# EAGLE design ESP_Robo_Board (EAGLE 9.6.2)
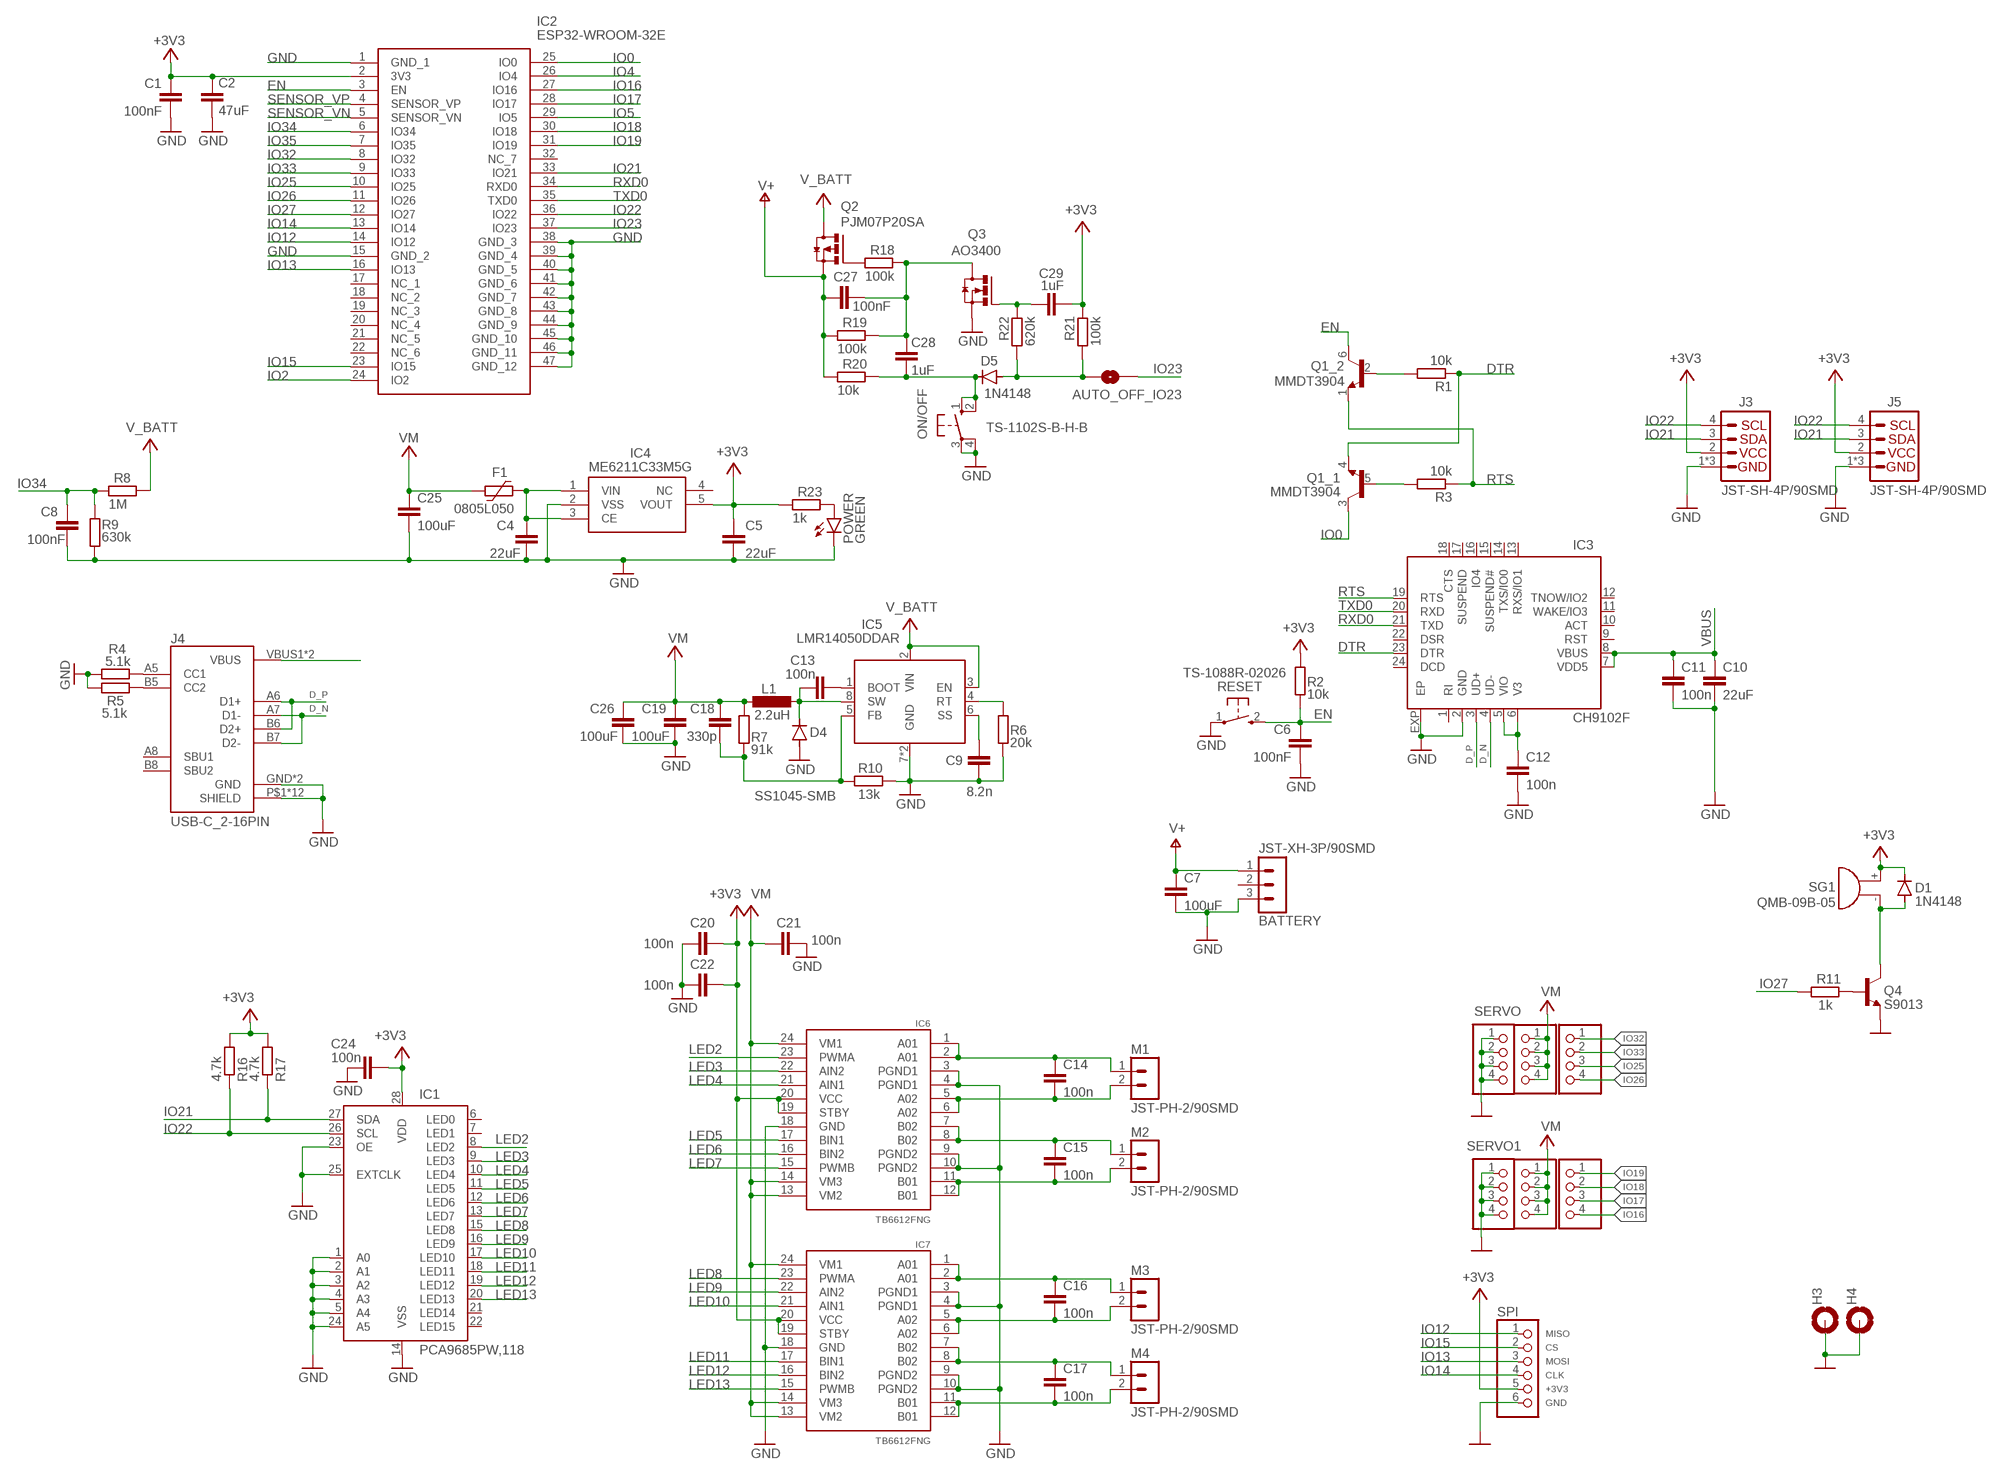
[diagram p0: schematic, sheet 1]

## Parts
1  PINHD_1X4_RED  PINHD-1X4  [1X04]
2  PINHD_1X4_BLACK  PINHD-1X4  [1X04]
5  PINHD_1X4_RED  PINHD-1X4  [1X04]
6  PINHD_1X4_BLACK  PINHD-1X4  [1X04]
AUTO_OFF_IO23  nv  JUMPER-SMT_2_NO_SILK  [SMT-JUMPER_2_NO_SILK]
BATTERY  JST-XH-3P/90SMD  JST-XH-3/90SMD  [S3B-XH-SM4]
C1  100nF  C-EUC0603  [C0603]
C2  47uF  C-EUC0805  [C0805]
C4  22uF  C-EUC0603  [C0603]
C5  22uF  C-EUC0603  [C0603]
C6  100nF  CAPACITOR_0402  [C0402]
C7  100uF  C-EUC1206  [C1206]
C8  100nF  CAPACITOR_0402  [C0402]
C9  8.2n  C-EUC0603  [C0603]
C10  22uF  C-EUC0603  [C0603]
C11  100n  CAPACITOR_0402  [C0402]
C12  100n  CAPACITOR_0402  [C0402]
C13  100n  C-EUC0603  [C0603]
C14  100n  C-EUC0603  [C0603]
C15  100n  C-EUC0603  [C0603]
C16  100n  C-EUC0603  [C0603]
C17  100n  C-EUC0603  [C0603]
C18  330p  CAPACITOR_0402  [C0402]
C19  100uF  C-EUC1206  [C1206]
C20  100n  C-EUC0603  [C0603]
C21  100n  C-EUC0603  [C0603]
C22  100n  C-EUC0603  [C0603]
C24  100n  C-EUC0603  [C0603]
C25  100uF  C-EUC1206  [C1206]
C26  100uF  C-EUC1206  [C1206]
C27  100nF  CAPACITOR_0402  [C0402]
C28  1uF  C-EUC0603  [C0603]
C29  1uF  C-EUC0603  [C0603]
D1  1N4148  DIODE-SOD323-R  [SOD323-R]
D4  SS1045-SMB  DIODE-SMB  [SMB]
D5  1N4148  DIODE-SOD323-R  [SOD323-R]
F1  0805L050  [0805L]
H3  MOUNT-PAD-ROUND2.5  [2,5-PAD]
H4  MOUNT-PAD-ROUND2.5  [2,5-PAD]
IC1  PCA9685PW,118  [TSSOP28]
IC2  ESP32-WROOM-32E  [ESP32WROOM32E]
IC3  CH9102F  USB_UART_CONVERTOR_CH9102  [QFN24-4X4]
IC4  ME6211C33M5G  LDO_ME6211C33M5G  [SOT23-5]
IC5  LMR14050DDAR  [SO08-EPAD]
IC6  TB6612FNG  MOTOR_DRIVER_TB6612FNG  [SSOP24]
IC7  TB6612FNG  MOTOR_DRIVER_TB6612FNG  [SSOP24]
J3  JST-SH-4P/90SMD  USUP_CONNECTOR_HOR  [1X04_1MM_RA]
J4  USB-C_2-16PIN  [USBC_USB-C-16P-5]
J5  JST-SH-4P/90SMD  USUP_CONNECTOR_HOR  [1X04_1MM_RA]
L1  2.2uH  INDUCTOR_5.4X5.2  [L5.4X5.2]
M1  JST-PH-2/90SMD  [S2B-PH-SM4]
M2  JST-PH-2/90SMD  [S2B-PH-SM4]
M3  JST-PH-2/90SMD  [S2B-PH-SM4]
M4  JST-PH-2/90SMD  [S2B-PH-SM4]
ON/OFF  TS-1102S-B-H-B  10-XX-SMD  [B3F-SMD]
POWER  GREEN  LEDCHIPLED_0402  [CHIPLED_0402]
Q1  MMDT3904  TRANS_NPN_DUAL-MBT3904DW1T1  [SC70-6]
Q2  PJM07P20SA  MOSFET_P-SOT-23  [SOT23]
Q3  AO3400  MOSFET_N-SOT-23  [SOT23]
Q4  S9013  BC817-16-NPN-SOT23-BEC  [SOT23-BEC]
R1  10k  R-EU_R0402  [R0402]
R2  10k  R-EU_R0402  [R0402]
R3  10k  R-EU_R0402  [R0402]
R4  5.1k  R-EU_R0402  [R0402]
R5  5.1k  R-EU_R0402  [R0402]
R6  20k  R-EU_R0402  [R0402]
R7  91k  R-EU_R0402  [R0402]
R8  1M  R-EU_R0402  [R0402]
R9  630k  R-EU_R0402  [R0402]
R10  13k  R-EU_R0402  [R0402]
R11  1k  R-EU_R0402  [R0402]
R16  4.7k  R-EU_R0402  [R0402]
R17  4.7k  R-EU_R0402  [R0402]
R18  100k  R-EU_R0402  [R0402]
R19  100k  R-EU_R0402  [R0402]
R20  10k  R-EU_R0402  [R0402]
R21  100k  R-EU_R0402  [R0402]
R22  620k  R-EU_R0402  [R0402]
R23  1k  R-EU_R0402  [R0402]
RESET  TS-1088R-02026  MOMENTARY_SWITCH_TS-1088R-02026  [TS1088R02026]
SERVO  PINHD_1X4_YELLOW  PINHD-1X4  [1X04]
SERVO1  PINHD_1X4_YELLOW  PINHD-1X4  [1X04]
SG1  QMB-09B-05  PASSIVE_5V_9/4MM  [9/4MM]
SPI  PINHD-1X6  [1X06]

## Nets
+3V3: C1.1 C2.1 C5.1 C20.2 C22.2 C24.2 C29.1 D1.C IC1.28(VDD) IC2.2(3V3) IC4.5(VOUT) IC6.19(STBY) IC6.20(VCC) IC7.19(STBY) IC7.20(VCC) J3.2(VCC) J5.2(VCC) R2.1 R16.2 R17.2 R21.2 R23.1 SG1.+ SPI.5
+6V: 1.1 1.2 1.3 1.4 5.1 5.2 5.3 5.4 C18.1 C19.1 C21.1 C25.1 C26.1 F1.2 IC6.13(VM2) IC6.14(VM3) IC6.24(VM1) IC7.13(VM2) IC7.14(VM3) IC7.24(VM1) L1.2 R7.1 ; supply symbol labelled VM
D_N: IC3.4(UD-) J4.A7(D1-) J4.B7(D2-)
D_P: IC3.3(UD+) J4.A6(D1+) J4.B6(D2+)
DTR: IC3.23(DTR) Q1.4(_1:E) R1.1
EN: C6.1 IC2.3(EN) Q1.6(_2:C) R2.2 RESET.2
GND: 2.1 2.2 2.3 2.4 6.1 6.2 6.3 6.4 BATTERY.3 C1.2 C2.2 C4.2 C5.2 C6.2 C7.2 C8.2 C9.2 C10.2 C11.2 C12.2 C19.2 C20.1 C21.2 C22.1 C24.1 C25.2 C26.2 D4.A H3.1(MOUNT) H4.1(MOUNT) IC1.1(A0) IC1.2(A1) IC1.3(A2) IC1.4(A3) IC1.5(A4) IC1.14(VSS) IC1.23(OE) IC1.24(A5) IC1.25(EXTCLK) IC2.1(GND_1) IC2.15(GND_2) IC2.38(GND_3) IC2.39(GND_4) IC2.40(GND_5) IC2.41(GND_6) IC2.42(GND_7) IC2.43(GND_8) IC2.44(GND_9) IC2.45(GND_10) IC2.46(GND_11) IC2.47(GND_12) IC3.2(GND) IC3.EXP(EP) IC4.2(VSS) IC5.7(GND) IC5.EPAD(GND) IC6.3(PGND1) IC6.4(PGND1) IC6.9(PGND2) IC6.10(PGND2) IC6.18(GND) IC7.3(PGND1) IC7.4(PGND1) IC7.9(PGND2) IC7.10(PGND2) IC7.18(GND) J3.1(GND) J3.NC1(GND) J3.NC2(GND) J4.GND J4.GND2(GND) J4.P$1(SHIELD) J4.P$2(SHIELD) J4.P$3(SHIELD) J4.P$4(SHIELD) J4.SHLD1(SHIELD) J4.SHLD2(SHIELD) J4.SHLD3(SHIELD) J4.SHLD4(SHIELD) J4.SHLD5(SHIELD) J4.SHLD6(SHIELD) J4.SHLD7(SHIELD) J4.SHLD8(SHIELD) J5.1(GND) J5.NC1(GND) J5.NC2(GND) ON/OFF.3(P) ON/OFF.4(P1) POWER.C Q3.2(S) Q4.E R4.1 R5.1 R6.2 R9.1 R10.2 RESET.1 SPI.6
IO0: IC2.25(IO0) Q1.3(_1:C)
IO2: IC2.24(IO2)
IO4: IC2.26(IO4)
IO5: IC2.29(IO5)
IO12: IC2.14(IO12) SPI.1
IO13: IC2.16(IO13) SPI.3
IO14: IC2.13(IO14) SPI.4
IO15: IC2.23(IO15) SPI.2
IO16: IC2.27(IO16) SERVO1.4
IO17: IC2.28(IO17) SERVO1.3
IO18: IC2.30(IO18) SERVO1.2
IO19: IC2.31(IO19) SERVO1.1
IO21: IC1.27(SDA) IC2.33(IO21) J3.3(SDA) J5.3(SDA) R17.1
IO22: IC1.26(SCL) IC2.36(IO22) J3.4(SCL) J5.4(SCL) R16.1
IO23: AUTO_OFF_IO23.2 IC2.37(IO23)
IO25: IC2.10(IO25) SERVO.3
IO26: IC2.11(IO26) SERVO.4
IO27: IC2.12(IO27) R11.1
IO32: IC2.8(IO32) SERVO.1
IO33: IC2.9(IO33) SERVO.2
IO34: C8.1 IC2.6(IO34) R8.1 R9.2
IO35: IC2.7(IO35)
LED2: IC1.8(LED2) IC6.23(PWMA)
LED3: IC1.9(LED3) IC6.22(AIN2)
LED4: IC1.10(LED4) IC6.21(AIN1)
LED5: IC1.11(LED5) IC6.17(BIN1)
LED6: IC1.12(LED6) IC6.16(BIN2)
LED7: IC1.13(LED7) IC6.15(PWMB)
LED8: IC1.15(LED8) IC7.23(PWMA)
LED9: IC1.16(LED9) IC7.22(AIN2)
LED10: IC1.17(LED10) IC7.21(AIN1)
LED11: IC1.18(LED11) IC7.17(BIN1)
LED12: IC1.19(LED12) IC7.16(BIN2)
LED13: IC1.20(LED13) IC7.15(PWMB)
N$1: C4.1 F1.1 IC4.1(VIN) IC4.3(CE)
N$2: J4.A5(CC1) R4.2
N$3: C13.1 D4.C IC5.8(SW) L1.1
N$4: Q1.5(_1:B) R3.2
N$5: C9.1 IC5.6(SS)
N$6: IC5.4(RT) R6.1
N$7: J4.B5(CC2) R5.2
N$8: Q4.B R11.2
N$9: POWER.A R23.2
N$10: C13.2 IC5.1(BOOT)
N$12: Q1.2(_2:B) R1.2
N$14: D1.A Q4.C SG1.-
N$15: C12.1 IC3.5(VIO) IC3.6(V3)
N$17: C18.2 IC5.5(FB) R7.2 R10.1
N$18: C14.1 IC6.1(A01) IC6.2(A01) M1.1
N$19: C14.2 IC6.5(A02) IC6.6(A02) M1.2
N$20: C15.1 IC6.7(B02) IC6.8(B02) M2.1
N$22: Q2.1(G) R18.1
N$23: C15.2 IC6.11(B01) IC6.12(B01) M2.2
N$24: C16.1 IC7.1(A01) IC7.2(A01) M3.1
N$25: C28.2 D5.C ON/OFF.1(S) ON/OFF.2(S1) R20.2
N$26: C16.2 IC7.5(A02) IC7.6(A02) M3.2
N$27: C17.1 IC7.7(B02) IC7.8(B02) M4.1
N$28: C27.2 C28.1 Q3.3(D) R18.2 R19.2
N$29: C17.2 IC7.11(B01) IC7.12(B01) M4.2
N$30: C29.2 Q3.1(G) R22.2
N$31: AUTO_OFF_IO23.1 D5.A R21.1 R22.1
RTS: IC3.19(RTS) Q1.1(_2:E) R3.1
RXD0: IC2.34(RXD0) IC3.21(TXD)
SENSOR_VN: IC2.5(SENSOR_VN)
SENSOR_VP: IC2.4(SENSOR_VP)
TXD0: IC2.35(TXD0) IC3.20(RXD)
V+: BATTERY.1 C7.1 C27.1 Q2.2(S) R19.1 R20.1
V_BATT: IC5.2(VIN) IC5.3(EN) Q2.3(D) R8.2
VBUS: C10.1 C11.1 IC3.7(VDD5) IC3.8(VBUS) J4.VBUS1(VBUS) J4.VBUS2(VBUS)
Unconnected: BATTERY.2 IC1.6(LED0) IC1.7(LED1) IC1.21(LED14) IC1.22(LED15) IC2.17(NC_1) IC2.18(NC_2) IC2.19(NC_3) IC2.20(NC_4) IC2.21(NC_5) IC2.22(NC_6) IC2.32(NC_7) IC3.1(RI) IC3.9(RST) IC3.10(ACT) IC3.11(WAKE/IO3) IC3.12(TNOW/IO2) IC3.13(RXS/IO1) IC3.14(TXS/IO0) IC3.15(SUSPEND#) IC3.16(IO4) IC3.17(SUSPEND) IC3.18(CTS) IC3.22(DSR) IC3.24(DCD) IC4.4(NC) J4.A8(SBU1) J4.B8(SBU2)

## Notes on the sheet
- MISO
- CS
- MOSI
- CLK
- +3V3
- GND

## Library data of the parts
1 2 5 6 SERVO SERVO1 = LasKKit-Connectors:PINHD-1X4: PIN HEADER
AUTO_OFF_IO23 = LaskaKit-Jumpers:JUMPER-SMT_2_NO: Normally open jumper This jumper has two pads in close proximity to each other. Apply solder to close the connection. Round pads are easier to solder for beginners, but are a lot larger. SparkFun Product that uses the round pads: SparkFun EL Sequencer <https://www.sparkfun.com/products/12781>
BATTERY = LasKKit-Connectors:JST-XH-3
C1 C2 C4 C7 C9 C10 C13-C17 C19-C22 C24-C26 C28 C29 = rcl:C-EU: CAPACITOR, European symbol; SPICEPREFIX: C
C5 = rcl:C-EU: CAPACITOR, European symbol; LCSC_PART: C19666; SPICEPREFIX: C
C6 C8 C11 C12 C18 C27 = LasKKIT-Passive:CAPACITOR
D1 = diode:DIODE-: DIODE; LCSC_PART: C94001
D4 = diode:DIODE-: DIODE; LCSC_PART: C2903947
D5 = LasKKit-Discrete:DIODE-: DIODE
F1 = polyfuse-smd_10:?: Polyfuse Resettable PTC Source: http://www.littelfuse.com/products/resettable-ptcs.aspx; LCSC_PART: C66452; MF: Littelfuse; MPN: 0805L050; OC_FARNELL: 1832103; OC_NEWARK: 18M4776
H3 H4 = LasKKit-Holes:MOUNT-PAD-ROUND: MOUNTING PAD, round
IC1 = LasKKit-IC:PCA9685: 16-channel, 12-bit PWM Fm+ I2C-bus LED controller; LCSC_PART: C2678753
IC2 = LasKKit-Modules:ESP32-WROOM-32E: ESP32-D0WD-V3 embedded, Xtensa dual-core 32-bit LX6 microprocessor, up to 240 MHz Source: Datasheet <https://www.espressif.com/sites/default/files/documentation/esp32-wroom-32e_esp32-wroom-32ue_datasheet_en.pdf>; DESCRIPTION: ESP32-D0WD-V3 embedded, Xtensa dual-core 32-bit LX6 microprocessor, up to 240 MHz; HEIGHT: 3.25mm; MANUFACTURER_NAME: Espressif Systems; MANUFACTURER_PART_NUMBER: ESP32-WROOM-32E
IC3 = LasKKit-IC:USB_UART_CONVERTOR_CH9102: Single-Chip USB to UART Bridge
IC4 = LasKKit-Power:LDO_ME6211C33M5G: High Speed LDO Regulators, High PSRR, Low noise, ME6211 Series Source: Datasheet <http://xinhuidianzi.com.cn/UploadSysFiles/files/LDO-series/ME6211-Series_E15.0.pdf>; DESCRIPTION: High Speed LDO Regulators, High PSRR, Low noise, ME6211 Series; HEIGHT: 1.45mm; MANUFACTURER_NAME: Microne; MANUFACTURER_PART_NUMBER: ME6211C33M5G
IC5 = LasKKit-Power:LMR14050; LCSC_PART: C155484
IC6 IC7 = LasKKit-IC:MOTOR_DRIVER_TB6612FNG: Toshiba 1A dual motor driver IC-09363; PROD_ID: IC-09363
J3 J5 = LasKKit-Connectors:USUP_CONNECTOR: LaskaKit I2C Standard Šup Connector An SMD 1mm pitch JST connector makes it easy and quick (Šup) to connect I2C devices to each other. The Šup system enables fast and solderless connection between popular platforms and various sensors and actuators. We carry 200mm <https://www.sparkfun.com/products/14204>, 100mm <https://www.sparkfun.com/products/14205>, 50mm <https://www.sparkfun.com/products/14206>, and breadboard friendly <https://www.sparkfun.com/products/14207> Qwiic cables. We also offer 10 pcs strips <https://www.sparkfun.com/products/14323> the SMD connectors.; LCSC_PART: C145956
J4 = LasKKit-Connectors:USB-C_2: https://lcsc.com/product-detail/USB-Connectors_G-Switch-GT-USB-7010B_C2837092.html; LCSC_PART: C2837092
L1 = LasKKIT-Passive:INDUCTOR; LCSC_PART: C351096
M1-M4 = LasKKit-Connectors:JST-PH-2: HEADER; LCSC_PART: C47647
ON/OFF = LasKKit-Switch:10-XX: OMRON SWITCH
POWER = LasKKit-Discrete:LED: LED OSRAM: - CHIPLED LG R971, LG N971, LY N971, LG Q971, LY Q971, LO R971, LY R971 LH N974, LH R974 LS Q976, LO Q976, LY Q976 LO Q996 - Hyper CHIPLED LW Q18S LB Q993, LB Q99A, LB R99A - SideLED LS A670, LO A670, LY A670, LG A670, LP A670 LB A673, LV A673, LT A673, LW A673 LH A674 LY A675 LS A676, LA A676, LO A676, LY A676, LW A676 LS A679, LY A679, LG A679 - Hyper Micro SIDELED® LS Y876, LA Y876, LO Y876, LY Y876 LT Y87S - SmartLED LW L88C, LW L88S LB L89C, LB L89S, LG L890 LS L89K, LO L89K, LY L89K LS L896, LA L896, LO L896, LY L896 - TOPLED LS T670, LO T670, LY T670, LG T670, LP T670 LSG T670, LSP T670, LSY T670, LOP T670, LYG T670 LG T671, LOG T671, LSG T671 LB T673, LV T673, LT T673, LW T673 LH T674 LS T676, LA T676, LO T676, LY T676, LB T676, LH T676, LSB T676, LW T676 LB T67C, LV T67C, LT T67C, LS T67K, LO T67K, LY T67K, LW E67C LS E67B, LA E67B, LO E67B, LY E67B, LB E67C, LV E67C, LT E67C LW T67C LS T679, LY T679, LG T679 LS T770, LO T770, LY T770, LG T770, LP T770 LB T773, LV T773, LT T773, LW T773 LH T774 LS E675, LA E675, LY E675, LS T675 LS T776, LA T776, LO T776, LY T776, LB T776 LHGB T686 LT T68C, LB T68C - Hyper Mini TOPLED® LB M676 - Mini TOPLED Santana® LG M470 LS M47K, LO M47K, LY M47K Source: http://www.osram.convergy.de LUXEON: - LUMILED® LXK2-PW12-R00, LXK2-PW12-S00, LXK2-PW14-U00, LXK2-PW14-V00 LXK2-PM12-R00, LXK2-PM12-S00, LXK2-PM14-U00 LXK2-PE12-Q00, LXK2-PE12-R00, LXK2-PE12-S00, LXK2-PE14-T00, LXK2-PE14-U00 LXK2-PB12-K00, LXK2-PB12-L00, LXK2-PB12-M00, LXK2-PB14-N00, LXK2-PB14-P00, LXK2-PB14-Q00 LXK2-PR12-L00, LXK2-PR12-M00, LXK2-PR14-Q00, LXK2-PR14-R00 LXK2-PD12-Q00, LXK2-PD12-R00, LXK2-PD12-S00 LXK2-PH12-R00, LXK2-PH12-S00 LXK2-PL12-P00, LXK2-PL12-Q00, LXK2-PL12-R00 Source: www.luxeon.com KINGBRIGHT: KA-3528ASYC Source: www.kingbright.com
Q1 = LasKKit-Discrete:TRANS_NPN_DUAL: Dual NPN Transistors in Single Package The MBT3904W1 puts two general purpose 3904 NPN transistors in a single package. Datasheet <http://www.onsemi.com/pub_link/Collateral/MBT3904DW1T1-D.PDF> SparkFun Products: SparkFun ESP32 Thing <https://www.sparkfun.com/products/13907>; LCSC_PART: C268586; PROD_ID: TRANS-13337
Q2 = LasKKit-Discrete:MOSFET_P; LCSC_PART: C2856842
Q3 = LasKKit-Discrete:MOSFET_N; LCSC_PART: C693097
Q4 = transistor:*-NPN-: NPN Transistror BF959 corrected 2008.03.06; LCSC_PART: C52801
R1-R10 R16-R23 = rcl:R-EU_: RESISTOR, European symbol; SPICEPREFIX: R
R11 = rcl:R-EU_: RESISTOR, European symbol; LCSC_PART: C22548; SPICEPREFIX: R
RESET = LasKKit-Switch:MOMENTARY_SWITCH_TS-1088R-02026: SMD,3x4x2.0mm Tactile Switches Source: Datasheet <https://datasheet.lcsc.com/szlcsc/1912111437_XUNPU-TS-1088R-02026_C455280.pdf>; DESCRIPTION: SMD,3x4x2.0mm Tactile Switches; HEIGHT: 2.2mm; LCSC_PART: C455280; MANUFACTURER_NAME: XUNPU; MANUFACTURER_PART_NUMBER: TS-1088R-02026
SG1 = LasKKit-Electromechanical:PASSIVE_5V: BUZZER Source: Buerklin; LCSC_PART: C161819
SPI = LasKKit-Connectors:PINHD-1X6: PIN HEADER

## Net classes
1 power: width 0.152 mm, drill 0.33 mm, clearance 0.152 mm

## Board
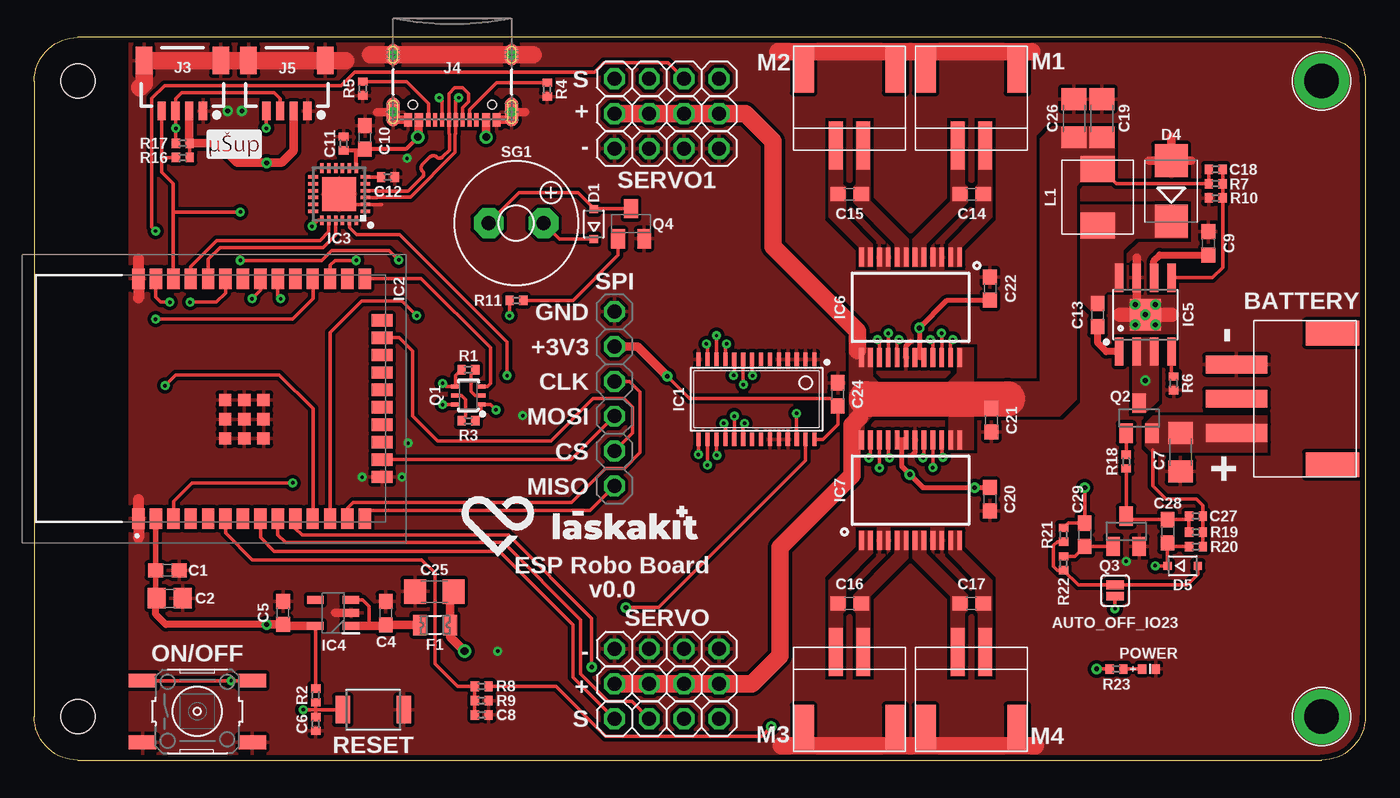
[diagram p1: board, top side]
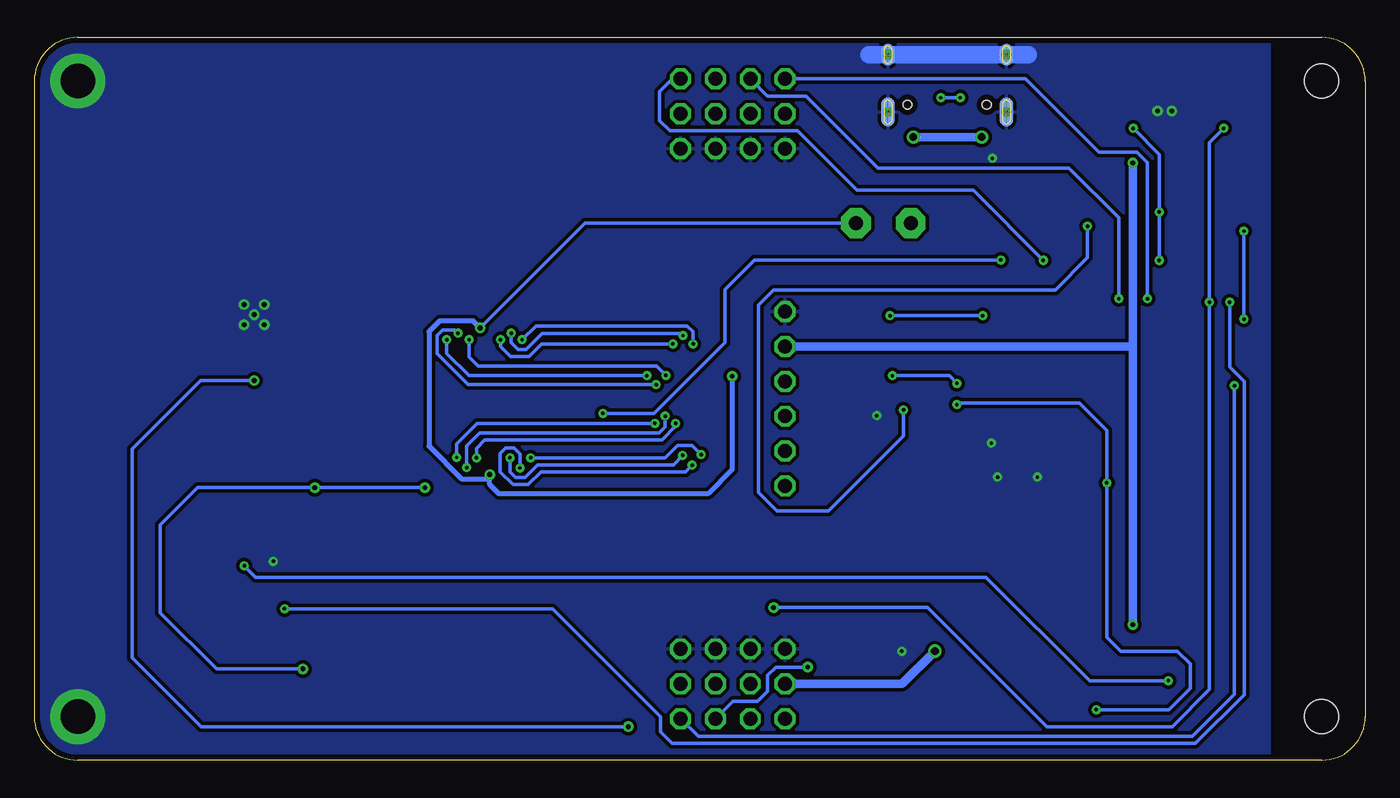
[diagram p2: board, bottom side, seen from below]

Size 97.03 x 52.7 mm. Coordinates in mm from the lower left corner, seen from the top.
Outline: 3.17,0 93.85,0 arc90 97.03,3.17 97.03,49.53 arc90 93.85,52.7 3.17,52.7 arc90 0,49.53 0,3.17 arc90 3.17,0
Copper layers (1*16): Top 0.035mm / dielectric 1.5mm / Bottom 0.035mm
Design rules "default *": minimum track width 10mil, minimum drill 0.35mm, track to track 6mil, track to pad 6mil, pad to pad 6mil, via to via 6mil, smd to smd 6mil, copper to edge 16mil, drill to drill 6mil, minimum pad ring 10mil, minimum via ring 8mil, stop-mask expansion 4mil, vias tented up to drill 25mil, thermal gap 10mil
Holes 2.5 mm at 3.17,3.17 3.17,49.53

### Footprints (pad centres in the part's own frame; a part is rotated, then mirrored left to right if it is on the bottom)
1X04 = drill 1.016 octagon: 1 -3.81,0; 2 -1.27,0; 3 1.27,0; 4 3.81,0
SMT-JUMPER_2_NO_SILK = smd 0.635 x 1.27: 1 -0.406,0; 2 0.406,0
S3B-XH-SM4 = smd 1.3 x 4.5: 1 2.5,-8.75; 2 0,-8.75; 3 -2.5,-8.75 | smd 1.8 x 3.9: P$1 -4.8,-1.75; P$2 4.8,-1.75
C0603 = smd 1.1 x 1: 1 -0.85,0; 2 0.85,0
C0805 = smd 1.3 x 1.5: 1 -0.95,0; 2 0.95,0
C0402 = smd 0.6 x 0.7: 1 -0.5,0; 2 0.5,0
C1206 = smd 1.6 x 1.8: 1 -1.4,0; 2 1.4,0
SOD323-R = smd 0.6 x 0.6: A 1.1,0; C -1.1,0
SMB = smd 2.4 x 2.4: A 2.2,0; C -2.2,0
0805L = smd 1 x 1.5: 1 -1.1,0; 2 1.1,0
2,5-PAD = drill 2.5 pad 4: 1 0,0
TSSOP28 = smd 0.305 x 0.991: 1 -4.225,-2.918; 2 -3.575,-2.918; 3 -2.925,-2.918; 4 -2.275,-2.918; 5 -1.625,-2.918; 6 -0.975,-2.918; 7 -0.325,-2.918; 8 0.325,-2.918; 9 0.975,-2.918; 10 1.625,-2.918; 11 2.275,-2.918; 12 2.925,-2.918; 13 3.575,-2.918; 14 4.225,-2.918; 15 4.225,2.918; 16 3.575,2.918; 17 2.925,2.918; 18 2.275,2.918; 19 1.625,2.918; 20 0.975,2.918; 21 0.325,2.918; 22 -0.325,2.918; 23 -0.975,2.918; 24 -1.625,2.918; 25 -2.275,2.918; 26 -2.925,2.918; 27 -3.575,2.918; 28 -4.225,2.918
ESP32WROOM32E = smd 1.5 x 0.9: 1 -8.742,8.28; 2 -8.742,7.01; 3 -8.742,5.74; 4 -8.742,4.47; 5 -8.742,3.2; 6 -8.742,1.93; 7 -8.742,0.66; 8 -8.742,-0.61; 9 -8.742,-1.88; 10 -8.742,-3.15; 11 -8.742,-4.42; 12 -8.742,-5.69; 13 -8.742,-6.96; 14 -8.742,-8.23; 25 8.758,-8.23; 26 8.758,-6.96; 27 8.758,-5.69; 28 8.758,-4.42; 29 8.758,-3.15; 30 8.758,-1.88; 31 8.758,-0.61; 32 8.758,0.66; 33 8.758,1.93; 34 8.758,3.2; 35 8.758,4.47; 36 8.758,5.74; 37 8.758,7.01; 38 8.758,8.28 | smd 0.9 x 1.5: 15 -5.702,-9.48; 16 -4.432,-9.48; 17 -3.162,-9.48; 18 -1.892,-9.48; 19 -0.622,-9.48; 20 0.648,-9.48; 21 1.918,-9.48; 22 3.188,-9.48; 23 4.458,-9.48; 24 5.728,-9.48 | smd 0.9 x 0.9: 39 -1.492,0.56; 40 -1.492,-0.84; 41 -0.092,-0.84; 42 -0.092,0.56; 43 -0.092,1.96; 44 -1.492,1.96; 45 -2.892,1.96; 46 -2.892,0.56; 47 -2.892,-0.84
QFN24-4X4 = smd 0.7 x 0.25: 1 -1.9,1.25; 2 -1.9,0.75; 3 -1.9,0.25; 4 -1.9,-0.25; 5 -1.9,-0.75; 6 -1.9,-1.25; 13 1.9,-1.25; 14 1.9,-0.75; 15 1.9,-0.25; 16 1.9,0.25; 17 1.9,0.75; 18 1.9,1.25 | smd 0.25 x 0.7: 7 -1.25,-1.9; 8 -0.75,-1.9; 9 -0.25,-1.9; 10 0.25,-1.9; 11 0.75,-1.9; 12 1.25,-1.9; 19 1.25,1.9; 20 0.75,1.9; 21 0.25,1.9; 22 -0.25,1.9; 23 -0.75,1.9; 24 -1.25,1.9 | smd 2.45 x 2.45: EXP 0,0
SOT23-5 = smd 1.2 x 0.6: 1 -1.3,0.95; 2 -1.3,0; 3 -1.3,-0.95; 4 1.3,-0.95; 5 1.3,0.95
SO08-EPAD = smd 0.61 x 2.057: 1 -1.905,-2.692; 2 -0.635,-2.692; 3 0.635,-2.692; 4 1.905,-2.692; 5 1.905,2.692; 6 0.635,2.692; 7 -0.635,2.692; 8 -1.905,2.692 | smd 2.286 x 2.286: EPAD 0,0
SSOP24 = smd 0.348 x 1.397: 1 -3.575,-3.656; 2 -2.925,-3.656; 3 -2.275,-3.656; 4 -1.625,-3.656; 5 -0.975,-3.656; 6 -0.325,-3.656; 7 0.325,-3.656; 8 0.975,-3.656; 9 1.625,-3.656; 10 2.275,-3.656; 11 2.925,-3.656; 12 3.575,-3.656; 13 3.575,3.656; 14 2.925,3.656; 15 2.275,3.656; 16 1.625,3.656; 17 0.975,3.656; 18 0.325,3.656; 19 -0.325,3.656; 20 -0.975,3.656; 21 -1.625,3.656; 22 -2.275,3.656; 23 -2.925,3.656; 24 -3.575,3.656
1X04_1MM_RA = smd 0.6 x 1.35: 1 1.5,-1.555; 2 0.5,-1.555; 3 -0.5,-1.555; 4 -1.5,-1.555 | smd 1.2 x 2: NC1 -2.8,2.12; NC2 2.8,2.12
USBC_USB-C-16P-5 = smd 0.3 x 1: A5 -1.25,-0.34; A6 -0.25,-0.34; A7 0.25,-0.34; A8 1.25,-0.34; B5 1.75,-0.34; B6 0.75,-0.34; B7 -0.75,-0.34; B8 -1.75,-0.34 | smd 0.6 x 1: GND -3.225,-0.34; GND2 3.225,-0.34; VBUS1 -2.45,-0.34; VBUS2 2.45,-0.34 | drill 0.2 pad 0.254: P$1 -4.32,-0.915; P$2 -4.32,-5.095; P$3 4.32,-5.095; P$4 4.32,-0.915 | smd 1 x 2.1: SHLD1 -4.32,-0.915; SHLD2 4.32,-0.915 | smd 1 x 2.1 bottom: SHLD3 -4.32,-0.915; SHLD4 4.32,-0.915 | smd 1 x 1.6: SHLD5 -4.32,-5.095; SHLD8 4.32,-5.095 | smd 1 x 1.6 bottom: SHLD6 -4.32,-5.095; SHLD7 4.32,-5.095 | hole 0.65: -2.89,-1.445; 2.89,-1.445
L5.4X5.2 = smd 1.895 x 2.5: 1 -2.05,0; 2 2.05,0
S2B-PH-SM4 = smd 1 x 3.5: 1 1,-7.25; 2 -1,-7.25 | smd 1.5 x 3.4: P$1 -3.35,-1.7; P$2 3.35,-1.7
B3F-SMD = smd 2 x 1: 1 -4,2.25; 2 4,2.25; 3 -4,-2.25; 4 4,-2.25
CHIPLED_0402 = smd 0.6 x 0.7: A -0.5,0; C 0.5,0
SC70-6 = smd 0.3 x 0.66: 1 -0.65,-0.92; 2 0,-0.92; 3 0.65,-0.92; 4 0.65,0.92; 5 0,0.92; 6 -0.65,0.92
SOT23 = smd 1 x 1.4: 1 -0.95,-1.1; 2 0.95,-1.1; 3 0,1.1
SOT23-BEC = smd 1 x 1.4: B -0.95,-1.1; C 0,1.1; E 0.95,-1.1
R0402 = smd 0.6 x 0.7: 1 -0.5,0; 2 0.5,0
TS1088R02026 = smd 1.05 x 2: 1 -2.225,0; 2 2.225,0
9/4MM = drill 1.016 pad 2.159 octagon: + 2,0; - -2,0
1X06 = drill 1.016 octagon: 1 -6.35,0; 2 -3.81,0; 3 -1.27,0; 4 1.27,0; 5 3.81,0; 6 6.35,0

### Placement (x,y rotation side)
1  46.1,5.56 0 top
2  46.1,8.1 0 top
5  46.1,47.14 0 top
6  46.1,44.6 0 top
AUTO_OFF_IO23  78.79,12.37 270 top
BATTERY  96.39,26.35 270 top
C1  9.7,13.84 0 top
C2  9.88,11.81 0 top
C4  25.63,10.72 90 top
C5  18.14,10.74 90 top
C6  20.52,2.64 270 top
C7  83.57,22.45 270 top
C8  32.61,3.3 0 top
C9  85.6,37.69 90 top
C10  24.1,45.42 90 top
C11  22.56,44.96 90 top
C12  25.78,42.52 0 top
C13  77.52,32.46 270 top
C14  68.33,41.27 180 top
C15  59.44,41.27 180 top
C16  59.44,11.43 0 top
C17  68.33,11.43 0 top
C18  86.13,43.08 0 top
C19  77.83,46.81 90 top
C20  69.67,19.02 90 top
C21  69.77,24.79 270 top
C22  69.67,34.39 270 top
C24  58.57,26.67 270 top
C25  29.16,12.29 180 top
C26  75.79,46.81 90 top
C27  84.68,17.81 180 top
C28  82.63,16.69 270 top
C29  76.58,16.43 270 top
D1  40.79,39.09 90 top
D4  82.88,41.5 90 top
D5  83.72,14.17 0 top
F1  29.21,9.86 0 top
H3  93.85,3.17 0 top
H4  93.85,49.53 0 top
IC1  52.65,26.31 180 top
IC2  15.88,26.35 90 top
IC3  22.23,41.27 180 top
IC4  21.79,10.74 180 top
IC5  81,32.49 0 top
IC6  63.88,33.02 180 top
IC7  63.88,19.68 0 top
J3  10.79,48.9 0 top
J4  30.48,46.35 180 top
J5  18.41,48.9 0 top
L1  77.52,41.05 90 top
M1  68.33,52.07 0 top
M2  59.44,52.07 0 top
M3  59.44,0.64 180 top
M4  68.33,0.64 180 top
ON/OFF  11.89,3.56 0 top
POWER  81.25,6.65 0 top
Q1  31.65,26.59 90 top
Q2  80.54,24.94 0 top
Q3  79.6,16.69 0 top
Q4  43.51,39.12 0 top
R1  31.65,28.47 0 top
R2  20.52,4.72 270 top
R3  31.65,24.74 180 top
R4  37.39,48.9 90 top
R5  23.95,48.97 90 top
R6  83.06,27.48 270 top
R7  86.13,42.04 0 top
R8  32.61,5.38 0 top
R9  32.61,4.34 180 top
R10  86.13,41 180 top
R11  35.15,33.53 0 top
R16  10.82,43.94 0 top
R17  10.82,44.98 0 top
R18  79.6,21.77 270 top
R19  84.68,16.64 180 top
R20  84.68,15.57 180 top
R21  75.03,16.43 90 top
R22  75.03,14.35 90 top
R23  78.89,6.65 0 top
RESET  24.71,3.68 180 top
SERVO  46.1,3.02 0 top
SERVO1  46.1,49.68 0 top
SG1  35.13,39.17 0 top
SPI  42.29,26.35 90 top
U$1  [USUP_4MM_SILKSCREEN]  14.58,44.91 0 top
U$3  [LASKKIT_20MM_SILKSCREEN]  39.95,16.99 0 top

### Tracks (layer width: path | path; a pad name or v marks a point on that pad's centre or on a via)
+3V3  (via drill 0.35)
  Top 0.254: R16.2 R17.2 | IC1.28 57.48,23.4 58.57,24.49 C24.2 58.03,26.37 58.03,26.36 47.78,26.36 v46.15,27.99 | R2.1 20.52,9.76 IC4.5 | R23.1 v77.44,6.66 | R21.2 75.38,17.28 C29.1 v76.58,19.88 | D1.C 38.3,37.99 SG1.+
  Top 0.356: IC7.19 63.23,23.34 | 63.23,23.34 IC7.20 | 64.53,29.36 v64.53,31.52 66.55,33.54 C22.2 | 64.53,29.36 IC6.19 | 64.53,29.36 IC6.20 | 63.23,23.34 63.23,21.44 v63.83,20.83 64.78,19.88 v68.56,19.88 C20.2
  Top 0.406: IC2.2 8.87,13.84 C1.1 8.85,11.81 C2.1
  Top 0.508: 18.24,9.79 C5.1 | 8.85,11.81 8.85,10.63 9.59,9.89 16.94,9.89 v16.94,9.88
  Top 0.61: J3.2 11.29,45.01 R17.2 13.36,44.98 14.78,43.56 v16.94,43.56 18.03,43.56 18.91,44.44 J5.2 | IC4.5 18.24,9.79 | C5.1 16.94,9.89 | SPI.5 43.98,30.16 v46.15,27.99
  Bottom 0.254: v77.44,6.66 83.74,6.66 87.83,10.74 87.83,17.14 85.1,19.88 v76.58,19.88 v68.56,19.88 | SG1.+ 56.88,39.17 v64.53,31.52
  Bottom 0.305: 63.83,20.52 v63.83,20.83
  Bottom 0.356: v64.53,31.52 65.04,32.03 67.46,32.03 68.25,31.24 68.25,22.91 65.86,20.52 63.83,20.52 | v46.15,27.99 46.15,21.21 47.93,19.43 63.14,19.43 63.83,20.12 v63.83,20.83
  Bottom 0.61: v16.94,9.88 16.94,30.18 | 16.94,30.18 v16.94,43.56 | SPI.5 16.95,30.16 16.94,30.18
+6V  (via drill 0.55)
  Top 0.254: L1.2 77.83,43.1 78.89,42.04 R7.1 C18.1 | 60.02,29.87 60.02,29.65
  Top 0.508: 30.31,12.04 C25.1
  Top 0.61: 30.31,12.04 F1.2 30.31,9.01 v31.37,7.95
  Top 1.27: 5.1 5.2 5.3 5.4 51.84,47.14 53.85,45.14 53.85,37.47 60.02,31.29 60.02,29.87 | 1.1 1.2 1.3 1.4 52.32,5.56 54.36,7.59 54.36,15.52 59.61,20.78 59.61,24.46 60.17,25.02
  Top 2.54: 60.66,26.34 70.94,26.34
  Bottom 0.61: 1.1 33.76,5.56 v31.37,7.95
  pour Top (no thermals): 73.3,25.07 73.3,45.34 74.19,46.23 78.79,46.23 78.79,42.14 76.28,42.14 76,41.86 76,26.31 74.75,25.07
  pour Top (no thermals): 73.53,27.61 68.48,27.61 68.48,25.07 73.53,25.07
  pour Top (no thermals): 67.26,30.07 67.26,28.24 66.62,27.61 66.62,22.63 68.5,22.63 68.5,30.07
  pour Top (no thermals): 61.14,30.07 59.39,30.07 59.39,22.63 60.5,22.63 60.5,24.46 61.11,25.07 61.49,25.07 61.49,27.61 61.14,27.97
D_N
  Top 0.254: IC3.4 24.98,41.52 25.03,41.48 27.25,41.48 28.29,42.51 arc90 28.29,42.96 arc-90 28.29,43.41 28.87,43.99 arc-90 29.32,43.99 arc90 29.77,43.99 30.28,44.5 30.28,45.64 30.23,45.69 J4.A7 30.23,48.62 30.63,49.02 31.24,49.02 31.65,48.62 31.65,48.01 31.23,47.59 J4.B7
D_P  (via drill 0.25)
  Top 0.254: IC3.3 24.98,41.02 25.03,41.07 27.42,41.07 30.68,44.33 30.68,45.64 30.73,45.69 J4.A6 30.73,48.1 v30.94,48.31 | J4.B6 29.73,48.1 v29.52,48.31
  Bottom 0.254: v29.52,48.31 v30.94,48.31
DTR  (via drill 0.25)
  Top 0.254: R1.1 30.73,28.05 Q1.4 30.01,27.24 v29.77,27.48 | v34.47,28.04 34.47,30.5 26.64,38.33 23.5,38.33 22.98,38.85 IC3.23
  Bottom 0.254: v29.77,27.48 30.33,28.04 v34.47,28.04
EN  (via drill 0.25)
  Top 0.254: RESET.2 20.52,3.68 | 20.52,3.68 R2.2 | C6.1 20.52,3.68 | Q1.6 29.78,25.94 v29.77,25.93 | v19.61,3.68 20.52,3.68 | v18.85,20.22 11.51,20.22 10.16,18.87 10.16,17.78 IC2.3
  Bottom 0.254: v19.61,3.68 14.3,3.68 12.75,5.23 12.75,7.01 13.69,7.95 17.83,7.95 18.85,8.97 v18.85,20.22 18.85,24.05 20.83,26.04 29.67,26.04 v29.77,25.93
GND  (via drill 0.25, 0.35)
  Top 0.254: 25.34,40.52 IC3.2 22.98,40.52 IC3.EXP
  Top 0.356: IC7.18 64.21,22.45 64.01,22.25 | IC6.18 63.56,30.21 63.88,30.53
  Top 0.61: 80.37,36.65 IC5.7 80.37,33.15 | D4.A 82.88,45.47 | D4.A 84.34,43.7 | D4.A 81.25,43.7 | D4.A 82.88,42.8 | J4.GND2 26.16,46.7 J4.SHLD4 24.99,47.27 | J4.GND 34.8,46.7 J4.SHLD3 35.79,47.27 | IC4.2 21.95,10.74
  Top 0.813: 7.59,36.55 IC2.38 7.59,33.71 | 7.59,19 IC2.1 7.59,16.23
  Top 1.016: 82.96,32.49 IC5.EPAD 80.97,32.46 79.12,32.46
  Top 1.27: 72.75,51.66 54.23,51.66 | 73,1.04 54.48,1.04 | 22.7,51.02 J3.NC1 8,49.35 7.67,49.02 | 24.53,51.45 J4.SHLD6 36.36,51.45
  Bottom 1.27: 24.55,51.45 J4.SHLD8 J4.SHLD6 36.18,51.45
  other vias: 81,32.49 80.26,33.22 81.74,33.22 80.26,31.75 81.74,31.75 79.6,14.5 27.18,43.89 35.61,25.12 14.1,47.35 15.14,47.35 33.78,7.95 27.25,23.11 26.8,20.65 23.9,20.65
  pour Top (isolate 0.254, rank 2): 6.99,0 6.99,52.7 97.03,52.7 97.03,0
  pour Bottom (isolate 0.254): 6.99,0 6.99,52.7 97.03,52.7 97.03,0
  pour Top (no thermals): 61.42,35.66 61.42,37.39 62.43,37.39 62.43,35.66
  pour Top (no thermals): 65.33,37.39 65.33,35.66 66.34,35.66 66.34,37.39
  pour Top (no thermals): 61.42,17.04 61.42,15.32 62.43,15.32 62.43,17.04
  pour Top (no thermals): 65.33,15.32 65.33,17.04 66.34,17.04 66.34,15.32
  pour Top (no thermals): 78.28,33.91 83.46,33.91 83.46,31.09 78.28,31.09
IO0
  Top 0.254: IC2.25 28.21,35.11 33.25,30.07 33.25,27.46 33.03,27.24 Q1.3
IO12
  Top 0.254: IC2.14 24.11,18.22 40.51,18.22 SPI.1
IO13
  Top 0.254: IC2.16 39.13,21.92 SPI.3
IO14
  Top 0.254: IC2.13 22.84,18.39 23.24,18.8 39.17,18.8 41.66,21.29 43.03,21.29 44.17,22.43 44.17,26.86 43.41,27.62 SPI.4
IO15
  Top 0.254: SPI.2 43.61,23.86 43.61,25.76 43,26.36 40.74,26.36 37.67,23.29 29.39,23.29 27.58,25.09 27.58,29.82 26.59,30.81 IC2.23
IO16  (via drill 0.25)
  Top 0.254: v23.47,36.45 21.92,36.45 21.57,36.09 IC2.27
  Bottom 0.254: v23.47,36.45 28.57,41.55 37.06,41.55 41.4,45.9 50.7,45.9 51.44,46.63 51.44,48.74 50.49,49.68 SERVO1.4
IO17  (via drill 0.25)
  Top 0.254: SERVO1.3 46.2,50.85 41.53,50.85 40.84,50.16 23.34,50.16 22.38,49.2 9.5,49.2 8.56,48.26 8.56,38.86 v8.84,38.58 | IC2.28 20.32,34.92 20.32,33.66 18.82,32.16 v8.84,32.16
  Bottom 0.254: v8.84,38.58 v8.84,32.16
IO18  (via drill 0.25)
  Top 0.254: IC2.30 17.75,33.86 v17.96,33.66
  Bottom 0.254: SERVO1.2 43.56,48.41 40.77,48.41 35.53,43.18 21.59,43.18 17.96,39.55 v17.96,33.66
IO19  (via drill 0.25)
  Top 0.254: IC2.31 | IC2.31 16.48,34.27 v15.88,33.66
  Bottom 0.254: v15.88,33.66 15.88,43.56 16.64,44.32 19.41,44.32 24.77,49.68 SERVO1.1
IO21  (via drill 0.25, 0.35)
  Top 0.254: J5.3 17.91,48.25 17.48,48.69 10.74,48.69 10.29,48.24 J3.3 10.29,46.09 v10.31,46.08 10.32,46.07 R17.1 | IC2.33 13.95,34.07 13.28,33.4 v11.35,33.4 | IC1.27 56.23,21.84 45.52,11.12 v43.13,11.12
  Bottom 0.254: v43.13,11.12 31.9,11.12 23.22,2.44 14.07,2.44 11.35,5.16 v11.35,33.4 11.35,45.03 v10.31,46.08
IO22  (via drill 0.25)
  Top 0.254: IC2.36 10.13,40.01 | 10.13,40.01 10.13,42.04 9.29,42.88 9.29,43.94 | 9.29,43.94 J3.4 | J5.4 v16.92,46.08 | R16.1 9.29,43.94 | IC1.26 v55.58,25.29 v55.58,25.3 | v26.57,36.47 25.88,37.16 21.67,37.16 20.95,36.45 v15.01,36.45 | v15.01,39.98 10.16,39.98 10.13,40.01
  Bottom 0.254: v55.58,25.3 51.84,25.3 46.69,30.45 46.69,34.31 44.53,36.47 v26.57,36.47 | v16.92,46.08 15.01,44.17 v15.01,39.98 v15.01,36.45
IO23  (via drill 0.25)
  Top 0.254: AUTO_OFF_IO23.2 v78.79,11.05 | v9.88,33.4 9.22,33.4 8.87,33.76 IC2.37 | IC2.37
  Bottom 0.254: v78.79,11.05 59.26,11.05 51.38,3.17 51.38,2.08 50.52,1.22 12.37,1.22 8.81,4.78 8.81,27.61 9.88,28.68 v9.88,33.4
IO25  (via drill 0.35)
  Top 0.254: IC2.10 19.02,16.92 19.53,16.41 31.01,16.41 34.57,16.41 40.64,10.34 v40.64,6.78
  Bottom 0.254: SERVO.3 46.1,4.29 44.3,4.29 43.56,5.03 43.56,6.17 42.95,6.78 v40.64,6.78
IO26  (via drill 0.25)
  Top 0.254: v9.53,27.3 10.31,28.09 17.86,28.09 20.32,25.63 20.32,17.78 IC2.11
  Bottom 0.254: v9.53,27.3 9.53,4.8 12.6,1.73 48.62,1.73 SERVO.4
IO27  (via drill 0.25)
  Top 0.254: IC2.12 21.57,31.17 23.88,33.48 26.82,33.48 v27.89,32.41 | v34.65,32.41 R11.1
  Bottom 0.254: v27.89,32.41 v34.65,32.41
IO32
  Top 0.254: SERVO.1 39.28,6.03 39.28,9.87 33.91,15.24 17.5,15.24 16.48,16.26 IC2.8
IO33
  Top 0.254: SERVO.2 43.56,4.29 41.83,4.29 39.84,6.29 39.84,10.25 34.21,15.88 18.31,15.88 17.75,16.43 IC2.9
IO34
  Top 0.254: C8.1 R9.2 R8.1 30.86,5.38 29.21,7.04 29.21,13.64 28.25,14.61 15.9,14.61 13.95,16.56 IC2.6
LED2  (via drill 0.25)
  Top 0.254: IC6.23 66.81,30.51 v66.95,30.66 | IC1.8 52.33,28.09 v52.38,28.04
  Bottom 0.254: v52.38,28.04 65.33,28.04 66.95,29.67 v66.95,30.66
LED3  (via drill 0.25)
  Top 0.254: IC6.22 66.16,31.13 v66.14,31.14 | IC1.9 v51.68,27.39 v51.69,27.38
  Bottom 0.254: v51.69,27.38 65.41,27.38 67.67,29.64 67.67,30.96 67.26,31.37 66.37,31.37 v66.14,31.14
LED4  (via drill 0.25)
  Top 0.254: IC6.21 65.51,30.48 v65.33,30.66 | IC1.10 51.03,28.12 v50.98,28.07
  Bottom 0.254: v50.98,28.07 51.66,28.75 64.67,28.75 65.33,29.41 v65.33,30.66
LED5  (via drill 0.25)
  Top 0.254: IC6.17 62.91,30.52 v63.04,30.66 | IC1.11 50.38,30.26 v50.47,30.35
  Bottom 0.254: v50.47,30.35 60.05,30.35 60.96,29.44 62.31,29.44 63.04,30.18 v63.04,30.66
LED6  (via drill 0.25)
  Top 0.254: IC6.16 v62.26,31.14 | IC1.12 v49.73,30.96
  Bottom 0.254: v49.73,30.96 49.89,31.11 59.99,31.11 61.16,29.95 61.75,29.95 62.26,30.45 v62.26,31.14
LED7  (via drill 0.25)
  Top 0.254: IC6.15 61.61,30.52 v61.47,30.66 | IC1.13 49.08,30.27 v49,30.35
  Bottom 0.254: v49,30.35 49,31.24 49.43,31.67 60.45,31.67 v61.47,30.66
LED8  (via drill 0.25)
  Top 0.254: IC7.23 60.96,22.17 v60.83,22.05 | IC1.15 48.43,22.29 v48.41,22.28
  Bottom 0.254: v48.41,22.28 49.07,22.94 50.14,22.94 51.03,22.05 v60.83,22.05
LED9  (via drill 0.25)
  Top 0.254: IC7.22 61.61,21.32 v61.62,21.31 | IC1.16 v49.08,21.52 v49.07,21.51
  Bottom 0.254: v61.62,21.31 61.62,22.33 62.05,22.76 62.66,22.76 63.07,22.35 63.07,21.03 62.13,20.09 61.04,20.09 60.1,21.03 49.55,21.03 v49.07,21.51
LED10  (via drill 0.25)
  Top 0.254: IC7.21 62.26,22.15 v62.36,22.05 | IC1.17 49.73,22.25 v49.76,22.23
  Bottom 0.254: v49.76,22.23 50.44,21.54 60.33,21.54 61.27,20.6 61.92,20.6 62.36,21.03 v62.36,22.05
LED11  (via drill 0.25)
  Top 0.254: IC7.17 64.86,22.11 v64.8,22.05 | IC1.18 50.38,24.45 v50.27,24.56
  Bottom 0.254: v50.27,24.56 50.27,24.36 51.28,23.34 64.19,23.34 64.8,22.73 v64.8,22.05
LED12  (via drill 0.25)
  Top 0.254: IC7.16 v65.51,21.34 | IC1.19 v51.03,25.09 | v51.03,25.09
  Bottom 0.254: v51.03,25.09 51.03,24.31 51.49,23.85 64.57,23.85 65.51,22.91 v65.51,21.34
LED13  (via drill 0.25)
  Top 0.254: IC7.15 66.16,22.16 v66.24,22.07 | IC1.20 51.68,24.45 v51.79,24.56
  Bottom 0.254: v51.79,24.56 64.75,24.56 66.24,23.06 v66.24,22.07
N$1
  Top 0.254: IC4.3 23.94,11.69 24.41,11.23 24.41,9.79
  Top 0.508: 25.63,9.79 C4.1 | 28.1,9.87 F1.1
  Top 0.61: IC4.1 24.41,9.79 25.63,9.79 | C4.1 28.1,9.87
N$2
  Top 0.254: J4.A5 31.73,47.43 33.7,49.4 R4.2
N$3
  pour Top (no thermals): 84.1,38.05 80.29,38.05 79.4,37.16 79.4,34.14 78.23,34.14 78.03,33.93 78.03,32.74 77.01,32.74 76.25,33.5 76.25,40.51 84.1,40.51
N$4
  Top 0.254: Q1.5 31.17,26.59 31.45,26.31 31.45,25.04 R3.2
N$5
  Top 0.508: IC5.6 81.64,36.42 82.06,36.84 C9.1
N$6
  Top 0.254: IC5.4 82.91,28.14 R6.1
N$7
  Top 0.254: J4.B5 28.73,47.88 27.14,49.47 R5.2
N$8
  Top 0.254: R11.2 39.27,33.53 42.56,36.82 Q4.B
N$9
  Top 0.254: POWER.A R23.2
N$10
  Top 0.508: IC5.1 78.16,29.79 77.52,30.43 C13.2
N$12
  Top 0.254: Q1.2 32.13,26.59 31.85,26.87 31.85,28.18 R1.2
N$14
  Top 0.254: Q4.C 40.82,40.22 | 40.82,40.22 D1.A | SG1.- 35.34,41.38 39.66,41.38 40.82,40.22
N$15
  Top 0.254: IC3.5 IC3.6 C12.1
N$17
  Top 0.254: C18.2 R7.2 R10.1 86.63,35.93 85.88,35.18 IC5.5
N$18
  pour Top (no thermals): 68.81,46.58 68.81,42.01 68.61,41.81 68.61,39.62 66.62,37.64 66.62,35.97 67.64,35.97 67.64,37.39 69.85,39.6 69.85,46.58
N$19
  pour Top (no thermals): 67.84,46.58 67.84,42.01 68.05,41.81 68.05,40.64 65.05,37.64 65.05,35.97 64.03,35.97 64.03,38 66.8,40.77 66.8,46.58
N$20
  pour Top (no thermals): 62.71,35.97 62.71,37.64 59.72,40.64 59.72,41.81 59.92,42.01 59.92,46.58 60.96,46.58 60.96,40.79 63.75,38 63.75,35.97
N$22
  Top 0.254: Q2.1 79.6,23.84 R18.1
N$23
  pour Top (no thermals): 61.14,35.97 61.14,37.64 59.16,39.62 59.16,41.81 58.95,42.01 58.95,46.58 57.91,46.58 57.91,39.6 60.12,37.39 60.12,35.97
N$24
  pour Top (no thermals): 61.14,16.74 61.14,15.06 59.16,13.08 59.16,10.92 58.95,10.72 58.95,6.12 57.91,6.12 57.91,13.11 60.12,15.32 60.12,16.74
N$25  (via drill 0.25)
  Top 0.254: R20.2 82.63,15.57 | 82.63,15.57 C28.2 | 82.63,15.57 82.62,15.57 D5.C v81.71,14.17 | 7.89,5.79 v14.35,5.79 15.89,5.79
  Top 0.406: ON/OFF.1 7.89,5.79 | ON/OFF.2 15.89,5.79
  Bottom 0.254: v14.35,5.79 20.09,5.79 27.64,13.34 80.87,13.34 v81.71,14.17
N$26
  pour Top (no thermals): 63.73,16.74 63.73,14.71 60.96,11.94 60.96,6.12 59.92,6.12 59.92,10.72 59.72,10.92 59.72,12.06 62.71,15.06 62.71,16.74
N$27
  pour Top (no thermals): 64.03,16.74 64.03,14.71 66.8,11.94 66.8,6.12 67.84,6.12 67.84,10.72 68.05,10.92 68.05,12.06 65.05,15.06 65.05,16.74
N$28
  Top 0.254: R18.2 Q3.3 79.6,17.54 C28.1 84.18,17.54 | C27.2 84.18,17.54 | R19.2 84.18,17.54
N$29
  pour Top (no thermals): 66.62,16.74 66.62,15.06 68.61,13.08 68.61,10.92 68.81,10.72 68.81,6.12 69.85,6.12 69.85,13.11 67.64,15.32 67.64,16.74
N$30
  Top 0.254: R22.2 75.85,14.85 C29.2 Q3.1
N$31
  Top 0.254: D5.A 84.82,13.55 84.05,12.78 AUTO_OFF_IO23.1 76.11,12.78 R22.1 74.59,13.85 74.3,14.15 74.3,15.65 74.58,15.93 R21.1
RTS  (via drill 0.25)
  Top 0.254: R3.1 32.57,25.16 Q1.1 33.26,25.94 v33.66,25.55 | IC3.19 20.68,39.38 v20.24,38.94
  Bottom 0.254: v20.24,38.94 20.24,36.65 22.61,34.29 43.13,34.29 44.25,33.17 44.25,19.53 42.9,18.19 39.12,18.19 33.66,23.65 v33.66,25.55
RXD0
  Top 0.254: IC2.34 12.68,36.52 13.54,37.39 21.06,37.39 21.98,38.31 IC3.21
TXD0
  Top 0.254: IC2.35 11.4,35.99 13.31,37.9 20.83,37.9 21.48,38.54 IC3.20
V+
  Top 0.254: R20.1 R19.1 C27.1 85.18,18.57 84.71,19.05 82.5,19.05 81.56,19.99 81.56,22.63
  pour Top (no thermals): 80.98,24.56 81.53,25.12 89.89,25.12 89.89,22.45 81.43,22.45 80.98,22.91
V_BATT  (via drill 0.35)
  Top 0.254: v53.72,2.44 53.03,1.75 41.66,1.75 38.02,5.38 R8.2
  Bottom 0.254: v53.72,2.44 84.86,2.44 89.89,7.47 89.89,22.71 84.91,27.69 v81,27.69
  pour Top (no thermals): 80.04,25.32 80.04,30.84 81.97,30.84 81.97,26.24 81.05,25.32
VBUS  (via drill 0.55)
  Top 0.254: IC3.8 IC3.7 | 24.13,44.45 C10.1
  Top 0.305: v27.96,45.44 27.09,44.56 C10.1 | 23.48,44.45 C11.1 | IC3.7 23.48,44.45 | 24.13,44.45 23.48,44.45
  Top 0.61: J4.VBUS2 28.03,45.51 v27.96,45.44 | J4.VBUS1 32.93,45.45 v32.94,45.44
  Bottom 0.61: v32.94,45.44 v27.96,45.44

### Text on the board
tNames: S | + | - | GND | - | +3V3 | CLK | MOSI | CS | + | MISO | ESP Robo Board | v0.0 | - | + | S